# EAGLE design LB_BIT_o9_BARGRAPH-v02(rev1) (EAGLE 6.6.0)
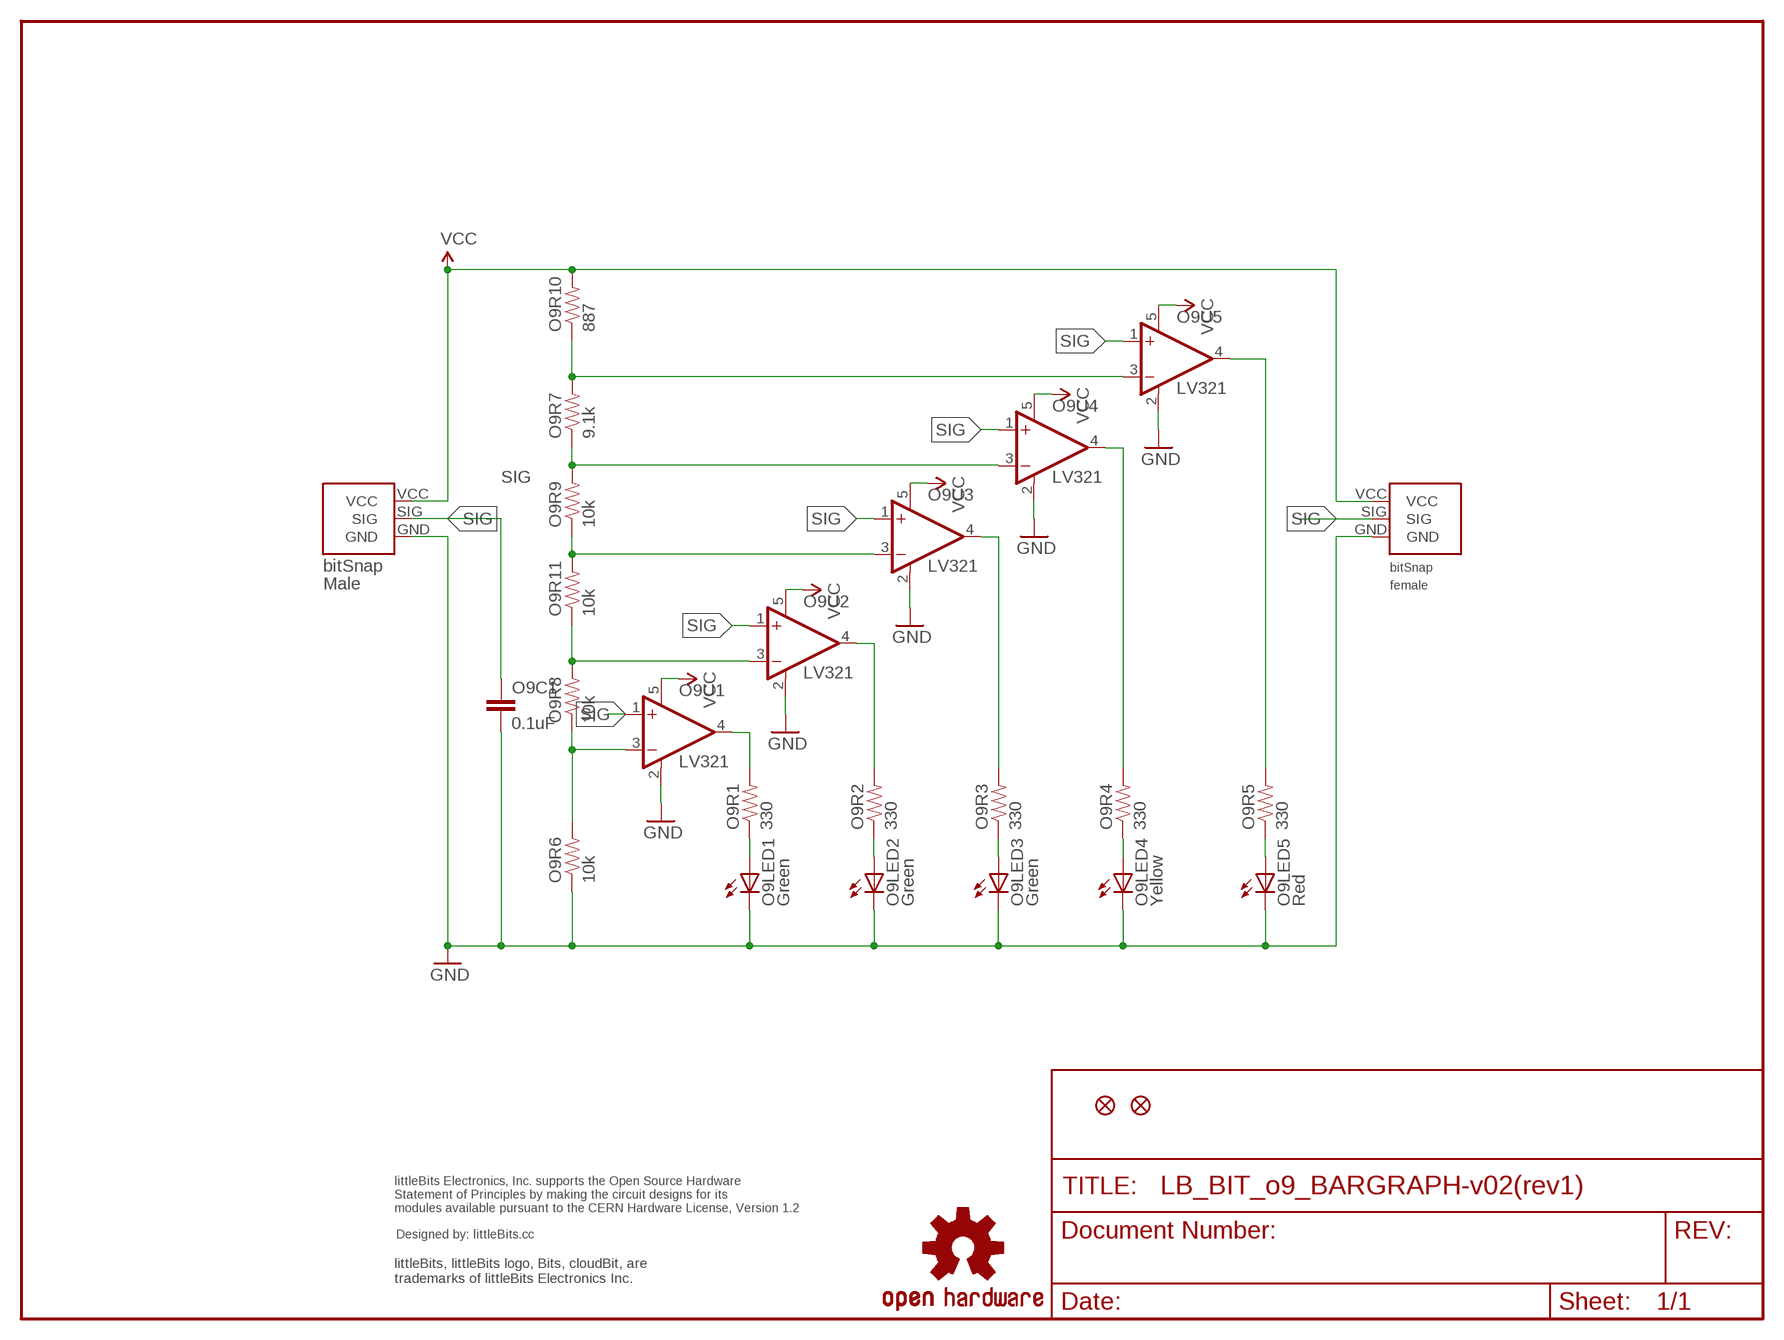
[diagram p0: schematic, sheet 1]

## Parts
JP1  FIDUCIAL1X2.5  [FIDUCIAL-1X2.5]
JP2  FIDUCIAL1X2.5  [FIDUCIAL-1X2.5]
O9BSF  BITSNAP_FEMALE  [BITSNAP_FEMALE]
O9BSM  BITSNAP_MALE  [BITSNAP_MALE]
O9C1  0.1uF  CAP0603-CAP  [0603-CAP]
O9LED1  Green  LED1206  [LED-1206]
O9LED2  Green  LED1206  [LED-1206]
O9LED3  Green  LED1206  [LED-1206]
O9LED4  Yellow  LED1206  [LED-1206]
O9LED5  Red  LED1206  [LED-1206]
O9R1  330  RESISTOR0603-RES  [0603-RES]
O9R2  330  RESISTOR0603-RES  [0603-RES]
O9R3  330  RESISTOR0603-RES  [0603-RES]
O9R4  330  RESISTOR0603-RES  [0603-RES]
O9R5  330  RESISTOR0603-RES  [0603-RES]
O9R6  10k  RESISTOR0603-RES  [0603-RES]
O9R7  9.1k  RESISTOR0603-RES  [0603-RES]
O9R8  10k  RESISTOR0603-RES  [0603-RES]
O9R9  10k  RESISTOR0603-RES  [0603-RES]
O9R10  887  RESISTOR0603-RES  [0603-RES]
O9R11  10k  RESISTOR0603-RES  [0603-RES]
O9U1  LV321  [SC70-5]
O9U2  LV321  [SC70-5]
O9U3  LV321  [SC70-5]
O9U4  LV321  [SC70-5]
O9U5  LV321  [SC70-5]
U$1  OSHWCREDIT  [OSHWCREDIT]
U$3  OSHW-LOGOL  [OSHW-LOGO-L]

## Nets
GND: O9BSF.GND O9BSM.GND O9C1.2 O9LED1.C O9LED2.C O9LED3.C O9LED4.C O9LED5.C O9R6.1 O9U1.2(V-) O9U2.2(V-) O9U3.2(V-) O9U4.2(V-) O9U5.2(V-)
N$1: O9R1.2 O9U1.4(OUT)
N$2: O9LED1.A O9R1.1
N$3: O9LED2.A O9R2.1
N$4: O9LED3.A O9R3.1
N$5: O9LED4.A O9R4.1
N$6: O9LED5.A O9R5.1
N$10: O9R2.2 O9U2.4(OUT)
N$11: O9R3.2 O9U3.4(OUT)
N$12: O9R4.2 O9U4.4(OUT)
N$13: O9R5.2 O9U5.4(OUT)
N$14: O9R6.2 O9R8.1 O9U1.3(-IN)
N$15: O9R8.2 O9R11.1 O9U2.3(-IN)
N$16: O9R9.1 O9R11.2 O9U3.3(-IN)
N$17: O9R7.1 O9R9.2 O9U4.3(-IN)
N$20: O9R7.2 O9R10.1 O9U5.3(-IN)
SIG: O9BSF.SIG O9BSM.SIG O9C1.1 O9U1.1(+IN) O9U2.1(+IN) O9U3.1(+IN) O9U4.1(+IN) O9U5.1(+IN)
VCC: O9BSF.VCC O9BSM.VCC O9R10.2 O9U1.5(V+) O9U2.5(V+) O9U3.5(V+) O9U4.5(V+) O9U5.5(V+)

## Library data of the parts
JP1 JP2 = abes:FIDUCIAL: Fiducial Alignment Points Various fiducial points for machine vision alignment.
O9BSF = bitSnap:BITSNAP_FEMALE
O9BSM = bitSnap:BITSNAP_MALE
O9C1 = SparkFun:CAP: Capacitor Standard 0603 ceramic capacitor, and 0.1" leaded capacitor.
O9LED1-O9LED5 = SparkFun:LED: LEDs Standard schematic elements and footprints for 5mm, 3mm, 1206, and 0603 sized LEDs. 5mm - Spark Fun Electronics SKU : COM-00529 (and others)
O9R1-O9R11 = SparkFun:RESISTOR: Resistor Basic schematic elements and footprints for 0603, 1206, and PTH 1/10th watt (small) resistors.
O9U1-O9U5 = LITTLEBITS:LV321
U$1 = LITTLEBITS:OSHWCREDIT
U$3 = SparkFun:OSHW-LOGO: Open Source Hardware Logo This logo indicates the piece of hardware it is found on incorporates a OSHW license and/or adheres to the definition of open source hardware found here: http://freedomdefined.org/OSHW

## Board
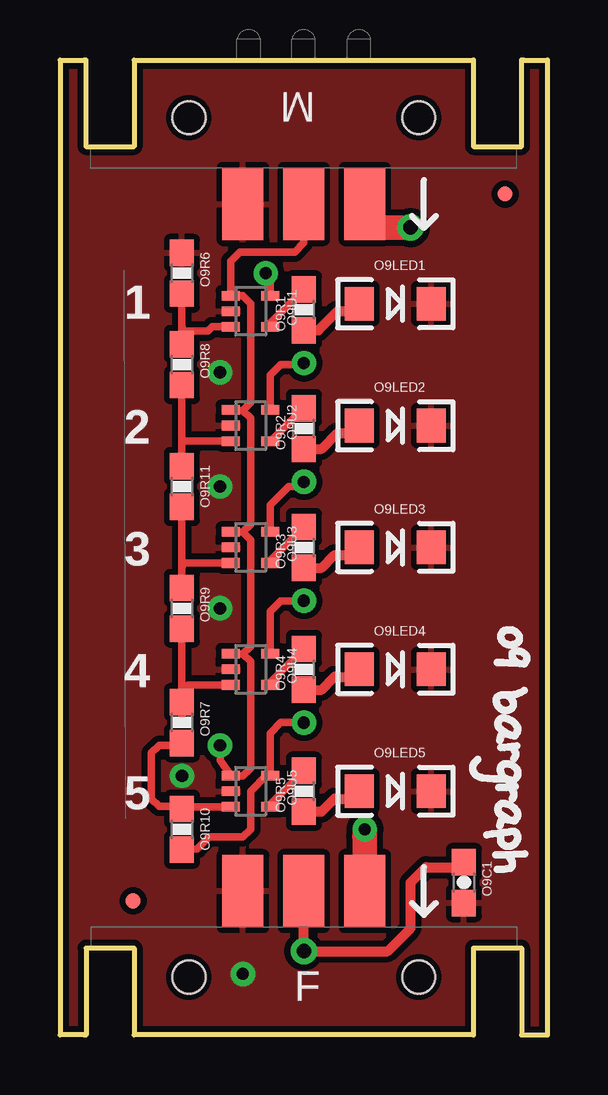
[diagram p1: board, top side]
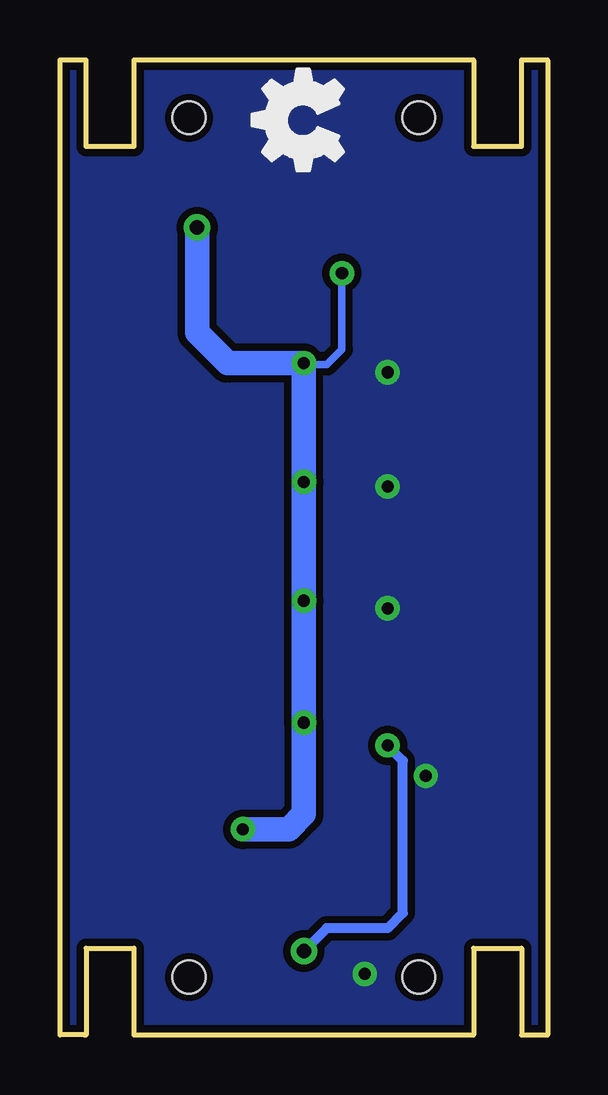
[diagram p2: board, bottom side, seen from below]

Size 20.32 x 40.64 mm. Coordinates in mm from the lower left corner, seen from the top.
Outline: 1.02,40.64 0,40.64 0,0 1.02,0
Outline: 19.3,40.64 20.32,40.64 20.32,0 19.3,0
Copper layers (1*16): Top 0.035mm / dielectric 1.5mm / Bottom 0.035mm
Design rules "default": minimum track width 8mil, minimum drill 20mil, track to track 8mil, track to pad 8mil, pad to pad 8mil, via to via 8mil, smd to smd 8mil, copper to edge 10mil, drill to drill 8mil, minimum pad ring 12mil, minimum via ring 10mil, stop-mask expansion 4mil, vias tented up to drill 25mil, thermal gap 10mil

### Footprints (pad centres in the part's own frame; a part is rotated, then mirrored left to right if it is on the bottom)
FIDUCIAL-1X2.5 = smd 0.635 x 0.635: 1 0,0
BITSNAP_FEMALE = smd 1.7 x 3: GND 6.35,6; SIG 8.89,6; VCC 11.43,6 | hole 1.37: 13.68,2.41; 4.1,2.41
BITSNAP_MALE = smd 1.7 x 3: GND 11.43,6; SIG 8.89,6; VCC 6.35,6 | hole 1.37: 13.68,2.41; 4.1,2.41
0603-CAP = smd 1.1 x 1: 1 -0.85,0; 2 0.85,0
LED-1206 = smd 1.2 x 1.4: A -1.5,0; C 1.5,0
0603-RES = smd 1.1 x 1: 1 -0.85,0; 2 0.85,0
SC70-5 = smd 0.4 x 0.75: 1 -0.65,-0.825; 2 0,-0.825; 3 0.65,-0.825; 4 0.65,0.825; 5 -0.65,0.825

### Placement (x,y rotation side)
JP1  18.54,35.05 0 top
JP2  3.05,5.59 0 top
O9BSF  1.27,0 0 top
O9BSM  19.05,40.64 180 top
O9C1  16.83,6.35 270 top
O9LED1  13.97,30.48 0 top
O9LED2  13.97,25.4 0 top
O9LED3  13.97,20.32 0 top
O9LED4  13.97,15.24 0 top
O9LED5  13.97,10.16 0 top
O9R1  10.16,30.23 90 top
O9R2  10.16,25.27 90 top
O9R3  10.16,20.32 90 top
O9R4  10.16,15.24 90 top
O9R5  10.16,10.16 90 top
O9R6  5.08,31.75 270 top
O9R7  5.08,13.02 270 top
O9R8  5.08,27.94 270 top
O9R9  5.08,17.78 270 top
O9R10  5.08,8.57 270 top
O9R11  5.08,22.86 270 top
O9U1  7.94,30.16 270 top
O9U2  7.94,25.4 270 top
O9U3  7.94,20.32 270 top
O9U4  7.94,15.24 270 top
O9U5  7.94,10.16 270 top
U$1  -16.51,-22.86 0 top  (outside the outline)
U$3  -12.38,-10.48 0 top  (outside the outline)
U$10  [OSHW_FILLX150_NOTEXT]  8.51,35.18 0 top

### Tracks (layer width: path | path; a pad name or v marks a point on that pad's centre or on a via)
GND  (via drill 0.51)
  other vias: 7.62,2.54 6.67,27.62 6.67,22.86 6.67,17.78 5.08,10.79
  pour Top (isolate 0.254): 0,40.64 0,0 20.32,0 20.32,40.64
  pour Bottom (isolate 0.305): 0,40.64 0,0 20.32,0 20.32,40.64
N$1
  Top 0.305: 10.14,31.11 O9R1.2 8.76,29.68 O9U1.4
N$2
  Top 0.406: O9R1.1 10.77,29.38 11.56,30.16 12.15,30.16 O9LED1.A
N$3
  Top 0.406: O9R2.1 10.9,24.42 11.56,25.08 12.15,25.08 O9LED2.A
N$4
  Top 0.406: O9R3.1 10.9,19.47 11.43,20 12.15,20 O9LED3.A
N$5
  Top 0.406: O9R4.1 10.9,14.39 11.43,14.92 12.15,14.92 O9LED4.A
N$6
  Top 0.406: O9R5.1 10.9,9.31 11.43,9.84 12.15,9.84 O9LED5.A
N$10
  Top 0.305: 10.29,26.04 10.18,26.04 O9R2.2 8.79,24.75 O9U2.4
N$11
  Top 0.305: 10.16,20.95 O9R3.2 8.76,19.77 O9U3.4
N$12
  Top 0.305: 10.16,15.88 O9R4.2 8.76,14.69 O9U4.4
N$13
  Top 0.305: O9R5.2 10.14,10.79 | O9R5.2 9.98,10.98 | O9U5.4 8.76,9.61 O9R5.2
N$14
  Top 0.305: 5.08,29.59 O9R6.2 | 5.08,29.59 O9R8.1 | 5.08,29.59 5.14,29.34 6.16,29.34 6.35,29.53 7.1,29.53 O9U1.3
N$15
  Top 0.305: 5.08,24.77 O9R11.1 | 5.08,24.77 O9R8.2 | O9U2.3 5.09,24.75 5.08,24.77
N$16
  Top 0.305: 5.08,19.68 5.08,19.51 | 5.08,19.68 O9R11.2 | 5.08,19.51 O9R9.1 | 5.08,19.51 5.09,19.5 | O9U3.3 5.09,19.67 5.08,19.68
N$17
  Top 0.305: 5.08,13.34 O9R7.1 5.08,14.5 | 5.08,14.5 O9R9.2 | 5.08,14.5 5.17,14.41 5.34,14.59 O9U4.3
N$20
  Top 0.305: O9U5.3 5.17,9.51 O9R10.1 5.08,9.53 4.13,9.53 3.81,9.84 3.81,11.75 4.13,12.06 4.98,12.06 O9R7.2
SIG  (via drill 0.51 pad 1.02, 0.6)
  Top 0.305: O9BSM.SIG 10.16,33.02 9.78,32.64 7.49,32.64 7.11,32.26 O9U1.1 7.61,30.81 7.94,30.48 7.94,26.35 7.62,26.04 | O9U2.1 7.13,26.04 7.62,26.04 | 7.62,26.04 7.94,25.72 7.94,21.27 7.62,20.95 | O9U3.1 7.13,20.95 7.62,20.95 | 7.62,20.95 7.94,20.64 7.94,16.19 7.62,15.88 | O9U4.1 7.13,15.88 7.62,15.88 | 7.62,15.88 7.94,15.56 7.94,11.11 7.62,10.79 7.13,10.79 O9U5.1 6.68,11.45 v6.67,12.06
  Top 0.406: O9BSF.SIG v10.16,3.49 13.65,3.49 14.61,4.45 14.61,6.35 15.24,6.99 16.81,6.99 16.81,7.18 O9C1.1
  Bottom 0.406: v6.67,12.06 6.03,11.43 6.03,5.08 6.67,4.45 9.21,4.45 v10.16,3.49
VCC  (via drill 0.51, 0.51 pad 1.02, 0.6)
  Top 0.305: O9R10.2 5.71,7.75 6.22,8.26 7.62,8.26 7.94,8.57 7.94,10.16 8.59,10.81 O9U5.5 8.76,12.57 9.21,13.02 v10.16,13.02 | 12.7,33.66 O9BSM.VCC | O9U1.5 8.76,31.56 v8.57,31.75 | O9U2.5 8.76,27.5 9.21,27.94 10.1,27.94 v10.16,28 | O9U3.5 8.76,22.1 9.53,22.86 9.97,22.86 v10.16,23.05 | O9U4.5 8.76,17.65 9.21,18.1 v10.16,18.1
  Top 0.406: v12.7,8.57 12.38,8.26
  Top 1.016: v12.7,8.57 O9BSF.VCC | v14.61,33.66 12.7,33.66
  Bottom 0.305: 10.29,27.18 v10.16,28 10.1,27.94 9.21,27.94 8.57,28.57 v8.57,31.75
  Bottom 1.016: v12.7,8.57 10.79,8.57 10.16,9.21 v10.16,13.02 v10.16,18.1 v10.16,23.05 v10.16,28 13.34,28 14.61,29.27 v14.61,33.66

### Text on the board
tPlace: 1 | 2 | 3 | 4 | 5